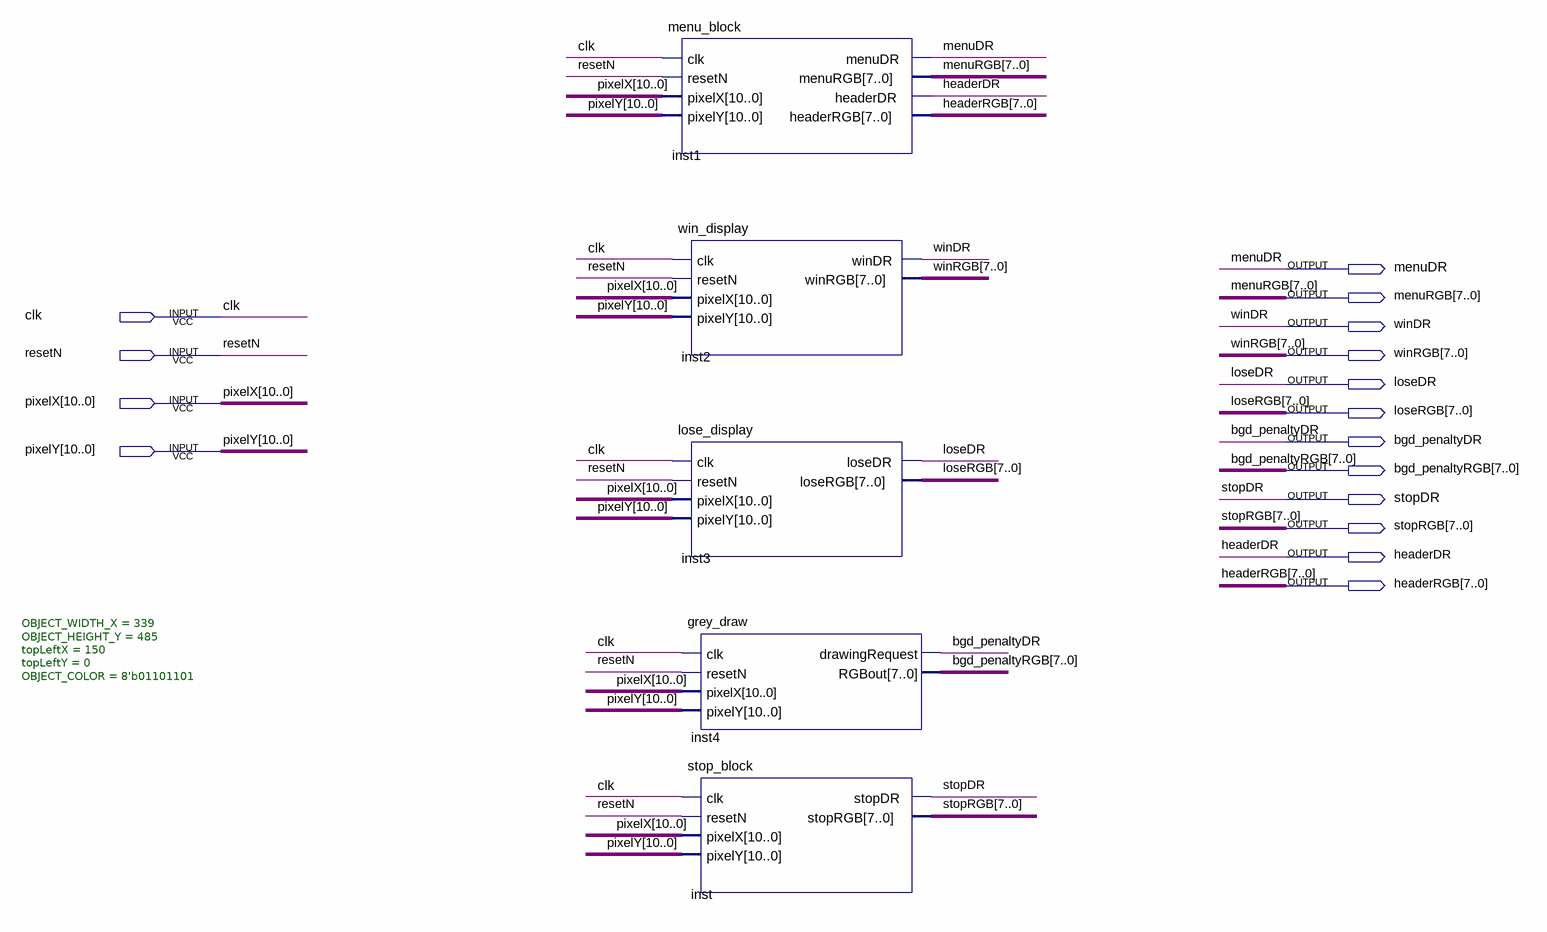
[diagram p0: schematic sheet]
// Quartus schematic display_block.bdf as structural Verilog: 5 symbols, 16 pins
module display_block (
  input  clk,
  input  resetN,
  input  [10:0] pixelX,
  input  [10:0] pixelY,
  output menuDR,
  output [7:0] menuRGB,
  output winDR,
  output [7:0] winRGB,
  output loseDR,
  output [7:0] loseRGB,
  output bgd_penaltyDR,
  output [7:0] bgd_penaltyRGB,
  output stopDR,
  output [7:0] stopRGB,
  output headerDR,
  output [7:0] headerRGB
);

  menu_block inst1 (
    .clk(clk), .resetN(resetN), .pixelX(pixelX), .pixelY(pixelY), .menuDR(menuDR), .menuRGB(menuRGB),
    .headerDR(headerDR), .headerRGB(headerRGB));
  win_display inst2 (.clk(clk), .resetN(resetN), .pixelX(pixelX), .pixelY(pixelY), .winDR(winDR), .winRGB(winRGB));
  lose_display inst3 (.clk(clk), .resetN(resetN), .pixelX(pixelX), .pixelY(pixelY), .loseDR(loseDR), .loseRGB(loseRGB));
  grey_draw #(.OBJECT_WIDTH_X(339), .OBJECT_HEIGHT_Y(485), .topLeftX(150), .topLeftY(0), .OBJECT_COLOR(8'b01101101)) inst4 (
    .clk(clk), .resetN(resetN), .pixelX(pixelX), .pixelY(pixelY), .drawingRequest(bgd_penaltyDR),
    .RGBout(bgd_penaltyRGB));
  stop_block inst (.clk(clk), .resetN(resetN), .pixelX(pixelX), .pixelY(pixelY), .stopDR(stopDR), .stopRGB(stopRGB));
endmodule
